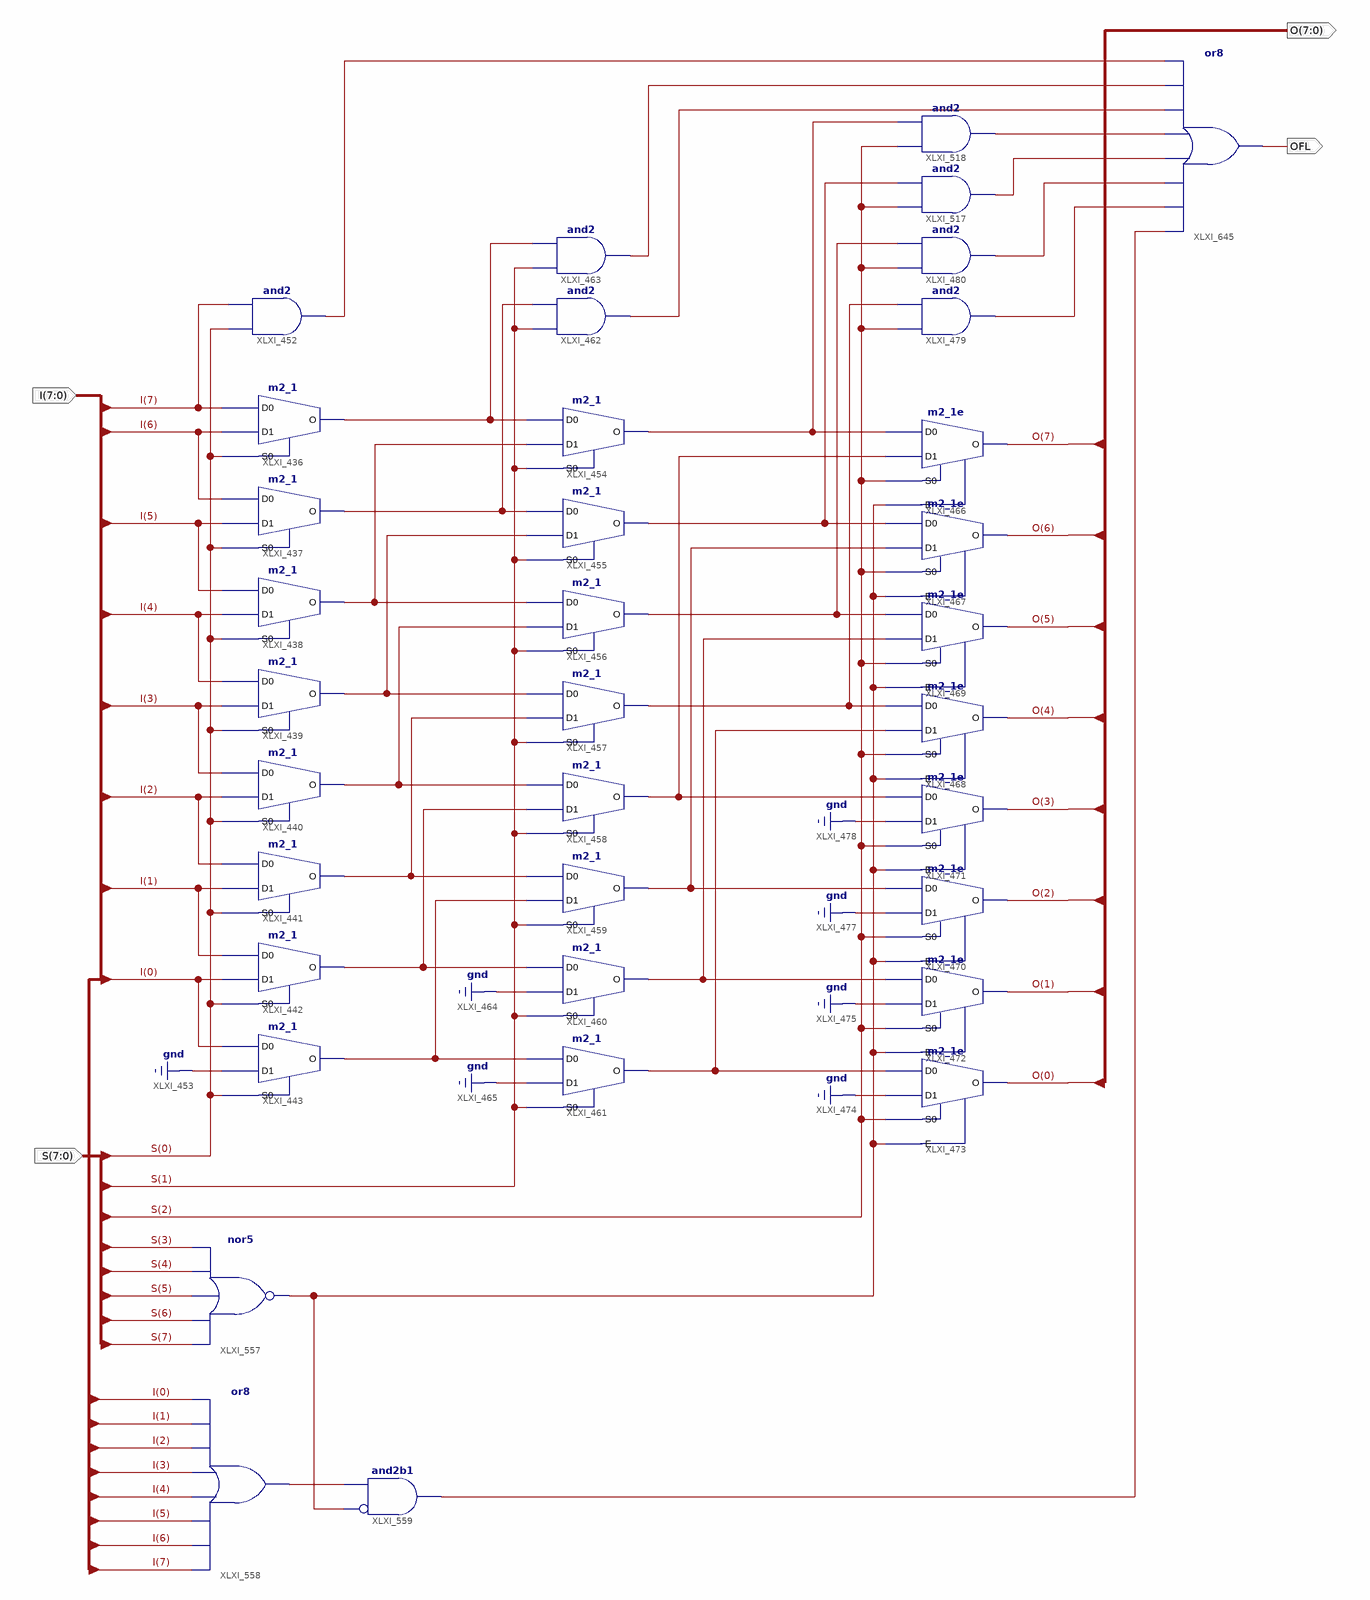
[diagram p0: schematic sheet 1]
// Xilinx ISE schematic lshift.sch (spartan6) as structural Verilog: 35 symbols, 4 ports
module lshift (
  input  [7:0] I,
  input  [7:0] S,
  output [7:0] O,
  output OFL
);

  wire XLXN_587, XLXN_588, XLXN_589, XLXN_590, XLXN_593, XLXN_594, XLXN_599, XLXN_600, XLXN_634, XLXN_635,
       XLXN_636, XLXN_637, XLXN_696, XLXN_697, XLXN_698, XLXN_699, XLXN_769, XLXN_770, XLXN_771, XLXN_840,
       XLXN_841, XLXN_842, XLXN_843, XLXN_844, XLXN_845, XLXN_846;

  m2_1 XLXI_436 (.D0(I[7]), .D1(I[6]), .S0(S[0]), .O(XLXN_600));
  m2_1 XLXI_437 (.D0(I[6]), .D1(I[5]), .S0(S[0]), .O(XLXN_599));
  m2_1 XLXI_438 (.D0(I[5]), .D1(I[4]), .S0(S[0]), .O(XLXN_587));
  m2_1 XLXI_439 (.D0(I[4]), .D1(I[3]), .S0(S[0]), .O(XLXN_588));
  m2_1 XLXI_440 (.D0(I[3]), .D1(I[2]), .S0(S[0]), .O(XLXN_589));
  m2_1 XLXI_441 (.D0(I[2]), .D1(I[1]), .S0(S[0]), .O(XLXN_590));
  m2_1 XLXI_442 (.D0(I[1]), .D1(I[0]), .S0(S[0]), .O(XLXN_593));
  m2_1 XLXI_443 (.D0(I[0]), .D1(1'b0), .S0(S[0]), .O(XLXN_594));
  and XLXI_452 (XLXN_771, S[0], I[7]);
  m2_1 XLXI_454 (.D0(XLXN_600), .D1(XLXN_587), .S0(S[1]), .O(XLXN_699));
  m2_1 XLXI_455 (.D0(XLXN_599), .D1(XLXN_588), .S0(S[1]), .O(XLXN_698));
  m2_1 XLXI_456 (.D0(XLXN_587), .D1(XLXN_589), .S0(S[1]), .O(XLXN_697));
  m2_1 XLXI_457 (.D0(XLXN_588), .D1(XLXN_590), .S0(S[1]), .O(XLXN_696));
  m2_1 XLXI_458 (.D0(XLXN_589), .D1(XLXN_593), .S0(S[1]), .O(XLXN_634));
  m2_1 XLXI_459 (.D0(XLXN_590), .D1(XLXN_594), .S0(S[1]), .O(XLXN_635));
  m2_1 XLXI_460 (.D0(XLXN_593), .D1(1'b0), .S0(S[1]), .O(XLXN_636));
  m2_1 XLXI_461 (.D0(XLXN_594), .D1(1'b0), .S0(S[1]), .O(XLXN_637));
  and XLXI_462 (XLXN_841, S[1], XLXN_599);
  and XLXI_463 (XLXN_840, S[1], XLXN_600);
  m2_1e XLXI_466 (.D0(XLXN_699), .D1(XLXN_634), .E(XLXN_770), .S0(S[2]), .O(O[7]));
  m2_1e XLXI_467 (.D0(XLXN_698), .D1(XLXN_635), .E(XLXN_770), .S0(S[2]), .O(O[6]));
  m2_1e XLXI_468 (.D0(XLXN_696), .D1(XLXN_637), .E(XLXN_770), .S0(S[2]), .O(O[4]));
  m2_1e XLXI_469 (.D0(XLXN_697), .D1(XLXN_636), .E(XLXN_770), .S0(S[2]), .O(O[5]));
  m2_1e XLXI_470 (.D0(XLXN_635), .D1(1'b0), .E(XLXN_770), .S0(S[2]), .O(O[2]));
  m2_1e XLXI_471 (.D0(XLXN_634), .D1(1'b0), .E(XLXN_770), .S0(S[2]), .O(O[3]));
  m2_1e XLXI_472 (.D0(XLXN_636), .D1(1'b0), .E(XLXN_770), .S0(S[2]), .O(O[1]));
  m2_1e XLXI_473 (.D0(XLXN_637), .D1(1'b0), .E(XLXN_770), .S0(S[2]), .O(O[0]));
  and XLXI_479 (XLXN_845, S[2], XLXN_696);
  and XLXI_480 (XLXN_844, S[2], XLXN_697);
  and XLXI_517 (XLXN_843, S[2], XLXN_698);
  and XLXI_518 (XLXN_842, S[2], XLXN_699);
  nor XLXI_557 (XLXN_770, S[7], S[6], S[5], S[4], S[3]);
  or XLXI_558 (XLXN_769, I[7], I[6], I[5], I[4], I[3], I[2], I[1], I[0]);
  and XLXI_559 (XLXN_846, ~XLXN_770, XLXN_769);  // and2b1
  or XLXI_645 (OFL, XLXN_846, XLXN_845, XLXN_844, XLXN_843, XLXN_842, XLXN_841, XLXN_840, XLXN_771);
endmodule
